# Altium schematic sheet ANA_FE.SchDoc: My title
size A3; Organization: University of California; Address1: 475 Portola Plaza; Address2: Los Angeles, CA 90095; Revision: R01; SheetNumber: 1; SheetTotal: 1
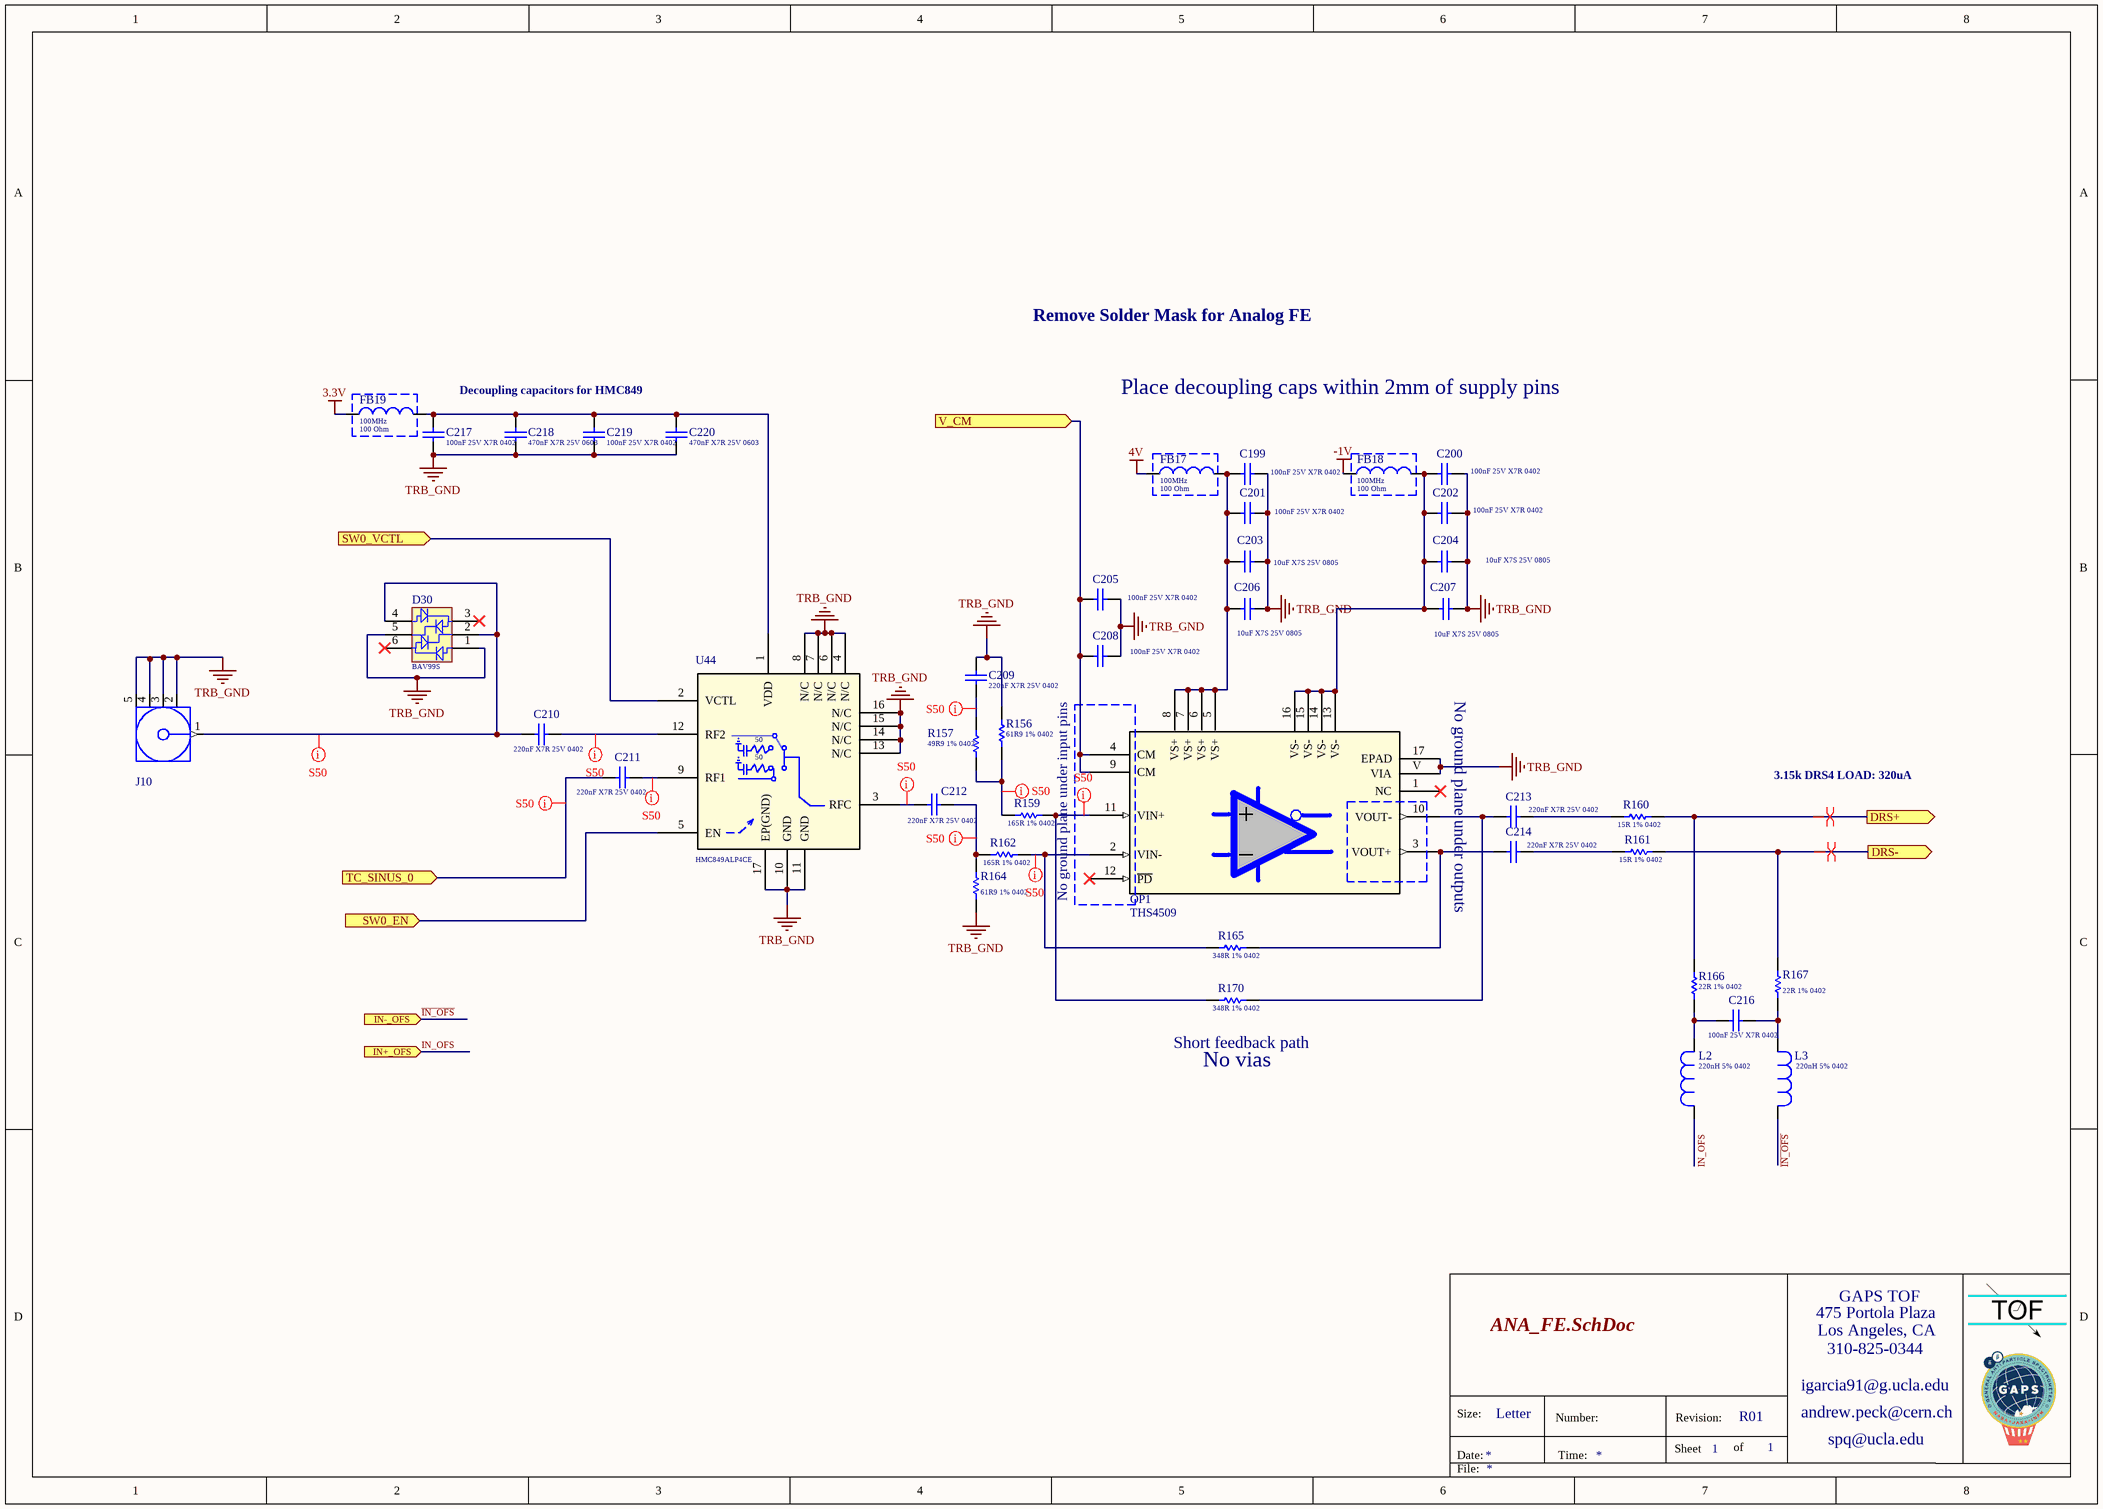
[diagram p0: ANA_FE.SchDoc]

## Parts
C199  Capacitance: 100nF 25V X7R 0402  [Cap_Taiyo_Yuden_TMK105B7104KV-FR_100nF]  (hidden comment: Cap_Taiyo_Yuden_TMK105B7104KV-FR_100nF)
C200  Capacitance: 100nF 25V X7R 0402  [Cap_Taiyo_Yuden_TMK105B7104KV-FR_100nF]  (hidden comment: Cap_Taiyo_Yuden_TMK105B7104KV-FR_100nF)
C201  Capacitance: 100nF 25V X7R 0402  [Cap_Taiyo_Yuden_TMK105B7104KV-FR_100nF]  (hidden comment: Cap_Taiyo_Yuden_TMK105B7104KV-FR_100nF)
C202  Capacitance: 100nF 25V X7R 0402  [Cap_Taiyo_Yuden_TMK105B7104KV-FR_100nF]  (hidden comment: Cap_Taiyo_Yuden_TMK105B7104KV-FR_100nF)
C203  Capacitance: 10uF X7S 25V 0805  [Cap_Murata_ GRM21BC71E106ME11L_10uF]  (hidden comment: Cap_Murata_ GRM21BC71E106ME11L_10uF)
C204  Capacitance: 10uF X7S 25V 0805  [Cap_Murata_ GRM21BC71E106ME11L_10uF]  (hidden comment: Cap_Murata_ GRM21BC71E106ME11L_10uF)
C205  Capacitance: 100nF 25V X7R 0402  [Cap_Taiyo_Yuden_TMK105B7104KV-FR_100nF]  (hidden comment: Cap_Taiyo_Yuden_TMK105B7104KV-FR_100nF)
C206  Capacitance: 10uF X7S 25V 0805  [Cap_Murata_ GRM21BC71E106ME11L_10uF]  (hidden comment: Cap_Murata_ GRM21BC71E106ME11L_10uF)
C207  Capacitance: 10uF X7S 25V 0805  [Cap_Murata_ GRM21BC71E106ME11L_10uF]  (hidden comment: Cap_Murata_ GRM21BC71E106ME11L_10uF)
C208  Capacitance: 100nF 25V X7R 0402  [Cap_Taiyo_Yuden_TMK105B7104KV-FR_100nF]  (hidden comment: Cap_Taiyo_Yuden_TMK105B7104KV-FR_100nF)
C209  Capacitance: 220nF X7R 25V 0402  [Cap_TDK_C1608X5R1A106M080AC_220nF]  (hidden comment: Cap_TDK_C1608X5R1A106M080AC_220nF)
C210  Capacitance: 220nF X7R 25V 0402  [Cap_TDK_C1608X5R1A106M080AC_220nF]  (hidden comment: Cap_TDK_C1608X5R1A106M080AC_220nF)
C211  Capacitance: 220nF X7R 25V 0402  [Cap_TDK_C1608X5R1A106M080AC_220nF]  (hidden comment: Cap_TDK_C1608X5R1A106M080AC_220nF)
C212  Capacitance: 220nF X7R 25V 0402  [Cap_TDK_C1608X5R1A106M080AC_220nF]  (hidden comment: Cap_TDK_C1608X5R1A106M080AC_220nF)
C213  Capacitance: 220nF X7R 25V 0402  [Cap_TDK_C1608X5R1A106M080AC_220nF]  (hidden comment: Cap_TDK_C1608X5R1A106M080AC_220nF)
C214  Capacitance: 220nF X7R 25V 0402  [Cap_TDK_C1608X5R1A106M080AC_220nF]  (hidden comment: Cap_TDK_C1608X5R1A106M080AC_220nF)
C216  Capacitance: 100nF 25V X7R 0402  [Cap_Taiyo_Yuden_TMK105B7104KV-FR_100nF]  (hidden comment: Cap_Taiyo_Yuden_TMK105B7104KV-FR_100nF)
C217  Capacitance: 100nF 25V X7R 0402  [Cap_Taiyo_Yuden_TMK105B7104KV-FR_100nF]  (hidden comment: Cap_Taiyo_Yuden_TMK105B7104KV-FR_100nF)
C218  Capacitance: 470nF X7R 25V 0603  [Cap_Wurth_Electronics_885012206075_470nF]  (hidden comment: Cap_Wurth_Electronics_885012206075_470nF)
C219  Capacitance: 100nF 25V X7R 0402  [Cap_Taiyo_Yuden_TMK105B7104KV-FR_100nF]  (hidden comment: Cap_Taiyo_Yuden_TMK105B7104KV-FR_100nF)
C220  Capacitance: 470nF X7R 25V 0603  [Cap_Wurth_Electronics_885012206075_470nF]  (hidden comment: Cap_Wurth_Electronics_885012206075_470nF)
D30  BAV99S  [INF-SOT363_V]
FB17  Measuring Frequency: 100MHz  Impedance: 100 Ohm  [FB_Wurth_Electronics_742792731_100Ohms]  (hidden comment: 742792731)
FB18  Measuring Frequency: 100MHz  Impedance: 100 Ohm  [FB_Wurth_Electronics_742792731_100Ohms]  (hidden comment: 742792731)
FB19  Measuring Frequency: 100MHz  Impedance: 100 Ohm  [FB_Wurth_Electronics_742792731_100Ohms]  (hidden comment: 742792731)
J10  CONREVSMA003.062  [CON-SMA-EDGE062]  (value not drawn)
L2  Inductance: 220nH 5% 0402  [Ind_TDK_ MLG1005SR22JT000_220nH]  (hidden comment: Ind_TDK_ MLG1005SR22JT000_220nH)
L3  Inductance: 220nH 5% 0402  [Ind_TDK_ MLG1005SR22JT000_220nH]  (hidden comment: Ind_TDK_ MLG1005SR22JT000_220nH)
OP1  THS4509  [RGT16]
R156  61R9 1% 0402  [RESC0402(1005)_L]
R157  49R9 1% 0402  [RESC0402(1005)_L]
R159  165R 1% 0402  [RESC0402(1005)_L]
R160  15R 1% 0402  [RESC0402(1005)_L]
R161  15R 1% 0402  [RESC0402(1005)_L]
R162  165R 1% 0402  [RESC0402(1005)_L]
R164  61R9 1% 0402  [RESC0402(1005)_L]
R165  348R 1% 0402  [RESC0402(1005)_L]
R166  22R 1% 0402  [RESC0402(1005)_L]
R167  22R 1% 0402  [RESC0402(1005)_L]
R170  348R 1% 0402  [RESC0402(1005)_L]
U44  HMC849  [CP_16_40]  (value not drawn)

## Ports
DRS+ (out), DRS- (out), IN+_OFS (in), IN-_OFS (in), SW0_EN (in), SW0_VCTL (in), TC_SINUS_0 (in), V_CM (in)

## Nets
3.3V: FB19.1
4V: FB17.1
-1V: FB18.1
TRB_GND: C199.2 C200.2 C201.2 C202.2 C203.1 C204.1 C205.2 C206.1 C207.1 C208.2 C209.1 C217.1 C218.2 C219.1 C220.2 D30.1(A1) D30.5(K5) J10.2(GND) J10.3(GND) J10.4(GND) J10.5(GND) OP1.17(EPAD) OP1.V(VIA) R156.2 R164.1 U44.4(N/C) U44.6(N/C) U44.7(N/C) U44.8(N/C) U44.10(GND) U44.11(GND) U44.13(N/C) U44.14(N/C) U44.15(N/C) U44.16(N/C) U44.17(EP(GND))
DRS+: R160.2 R166.2 ; port DRS+
DRS-: R161.2 R167.2 ; port DRS-
~{IN}~{_OFS}: L3.1 ; port IN-_OFS
IN_OFS: L2.2 ; port IN+_OFS
SW0_EN: U44.5(EN) ; port SW0_EN
SW0_VCTL: U44.2(VCTL) ; port SW0_VCTL
TC_SINUS_0: C211.2 ; port TC_SINUS_0
V_CM: C205.1 C208.1 OP1.4(CM) OP1.9(CM) ; port V_CM
NetC199_1: C199.1 C201.1 C203.2 C206.2 FB17.2 OP1.5(VS+) OP1.6(VS+) OP1.7(VS+) OP1.8(VS+)
NetC200_1: C200.1 C202.1 C204.2 C207.2 FB18.2 OP1.13(VS-) OP1.14(VS-) OP1.15(VS-) OP1.16(VS-)
NetC209_2: C209.2 R157.2
NetC210_1: C210.1 U44.12(RF2)
NetC210_2: C210.2 D30.2(K2) D30.4(A4) J10.1(Signal)
NetC211_1: C211.1 U44.9(RF1)
NetC212_1: C212.1 R162.1 R164.2
NetC212_2: C212.2 U44.3(RFC)
NetC213_1: C213.1 R160.1
NetC213_2: C213.2 OP1.10(VOUT-) R170.2
NetC214_1: C214.1 R161.1
NetC214_2: C214.2 OP1.3(VOUT+) R165.2
NetC216_1: C216.1 L2.1 R166.1
NetC216_2: C216.2 L3.2 R167.1
NetC217_2: C217.2 C218.1 C219.2 C220.1 FB19.2 U44.1(VDD)
NetOP1_2: OP1.2(VIN-) R162.2 R165.1
NetOP1_11: OP1.11(VIN+) R159.2 R170.1
NetR156_1: R156.1 R157.1 R159.1

Not connected (* = marked no-connect by the designer): D30 3(C3)* 6(C6)*; OP1 1(NC)* 12(~{PD})*

## Layout directives
net class S50: NetC209_2, NetC210_1, NetC210_2, NetC211_1, NetC212_1, NetC212_2, NetOP1_2, NetOP1_11, NetR156_1, TC_SINUS_0
differential pair: DRS+, DRS-

## Notes on the sheet
- Remove Solder Mask for Analog FE
- Decoupling capacitors for HMC849
- Place decoupling caps within 2mm of supply pins
- No ground plane under outputs
- 3.15k DRS4 LOAD: 320uA
- (near R159) No ground plane under input pins
- (near R170) Short feedback path
- (near R170) No vias
- 475 Portola Plaza
- GAPS TOF
- igarcia91@g.ucla.edu
- Los Angeles, CA
- 310-825-0344
- Size:
- Date:
- Letter
- Number:
- Time:
- Sheet
- Revision:
- of
- andrew.peck@cern.ch
- spq@ucla.edu
- File:
- (in symbol HMC849ALP4CE) 50

## Library data of the parts
C199-C202 C205 C208 C216 C217 C219 = Cap_Taiyo_Yuden_TMK105B7104KV-FR_100nF: CAP CER 100nF 25V X7R 0402; Supplier 1: Mouser; Supplier Part Number 1: 963-TMK105B7104KV-FR
C203 C204 C206 C207 = Cap_Murata_ GRM21BC71E106ME11L_10uF: CAP CER 10uF 25V X7R 0805; Supplier 1: Mouser; Supplier Part Number 1: 81-GRM21BC71E106ME1L
C209-C214 = Cap_TDK_C1608X5R1A106M080AC_220nF: CAP CER 220nF 50V X7R 0402; Supplier 1: Mouser; Supplier Part Number 1: 810-C1005X7R1E224KBE
C218 C220 = Cap_Wurth_Electronics_885012206075_470nF: CAP CER 470nF 25V X7R 0603; Supplier 1: Mouser; Supplier Part Number 1: 710-885012206075
D30 = CMP-1176-00030-1: Silicon Switching Diode, SOT363, Reel, Green; Manufacturer: Infineon; VR (max): 80Â V; VBR (min): 85Â V; IF (max): 200Â mA; trr (max): 4Â ns; Green: TRUE; VF (max): 1.25Â V; Configuration: Quadruple; IR (max): 150Â nA; PackageReference: SOT363; Halogen-free: TRUE; ComponentLink3URL: http://www.infineon.com/dgdl/SOT363-Package_Overview.pdf?folderId=db3a30431936bc4b01195360bd8f3cdc&fileId=db3a30431936bc4b0119536b62bf3cf5; PartNumber: BAV99S; ComponentLink3Description: Package Specification; ComponentLink2URL: http://www.infineon.com/dgdl/bav99series.pdf?folderId=db3a30431400ef6801141b5844e103ea&fileId=db3a30431400ef6801141c1b237d042f; ComponentLink1Description: Manufacturer URL; ComponentLink2Description: Datasheet; ComponentLink1URL: http://www.infineon.com/; PackageDescription: 6-Pin Small Outline Transistor Package, 1.25 x 2 mm Body; Mounting Technology: Surface Mount
FB17-FB19 = FB_Wurth_Electronics_742792731_100Ohms: FB SMD 100 OHM 25% 1.2A 0402; DC Resistance: 90mOhm; Supplier 1: Mouser; Supplier Part Number 1: 710-742792731
J10 = CMP-0168-00046-1: PCB_Layout: Pads complies with manufacturer's recommendation.; DatasheetVersion: rev1.0, Jun-2006; PackageVersion: rev1.0, Jun-2006; PackageReference: CON-SMA-EDGE062
L2 L3 = Ind_TDK_ MLG1005SR22JT000_220nH: Fixed Inductors .22 UH 5%; Supplier 1: Mouser; Supplier Part Number 1: 810-MLG1005SR22JT000
OP1 = THS4509RGTT: Imported; Vendor: Texas Instruments; Built_By: EMA_UL_Team; C: Copyright (C) 2015 Accelerated Designs. All rights reserved; Manufacturer_Part_Number: THS4509RGTT; RefDes: RefDes; Type: DEV; Value: Value; Supplier 1: Mouser; Supplier Part Number 1: 595-THS4509RGTT
R156 R164 = CMP-1011-00374-1: 61R9 0.063W 1% 0402 (1005 Metric)  SMD; Value: 61.90 Ohm; Case-EIA: 0402; Case-Metric: 1005; Tolerance: 1 %; Technology: SMT; Power: 0.063 W
R157 = CMP-1011-00363-1: 49R9 0.063W 1% 0402 (1005 Metric)  SMD; Case-EIA: 0402; Case-Metric: 1005; Value: 49.90 Ohm; Power: 0.063 W; Technology: SMT; Tolerance: 1 %
R159 R162 = CMP-1011-00420-1: 165R 0.063W 1% 0402 (1005 Metric)  SMD; Case-EIA: 0402; Case-Metric: 1005; Value: 165.00 Ohm; Power: 0.063 W; Technology: SMT; Tolerance: 1 %
R160 R161 = CMP-1011-00302-1: 15R 0.063W 1% 0402 (1005 Metric)  SMD; Case-Metric: 1005; Case-EIA: 0402; Value: 15.00 Ohm; Tolerance: 1 %; Power: 0.063 W; Technology: SMT
R165 R170 = CMP-1011-00457-1: 348R 0.063W 1% 0402 (1005 Metric)  SMD; Case-EIA: 0402; Value: 348.00 Ohm; Case-Metric: 1005; Tolerance: 1 %; Technology: SMT; Power: 0.063 W
R166 R167 = CMP-1011-00320-1: 22R 0.063W 1% 0402 (1005 Metric)  SMD; Case-EIA: 0402; Case-Metric: 1005; Value: 22.00 Ohm; Tolerance: 1 %; Technology: SMT; Power: 0.063 W
U44 = HMC849ALP4CE: RF Switch ICs DC-6 GHZ Hi Isolation Switch; Vendor: Analog Devices Inc; Built_By: Analog Devices Imc.; Manufacturer_Part_Number: HMC849ALP4CE; RefDes: RefDes; Type: DEV; Supplier 1: Mouser; Supplier Part Number 1: 584-HMC849ALP4CE; Series: HMC849ALP4CE